# EAGLE schematic uino-1284p (EAGLE 7.7.0)
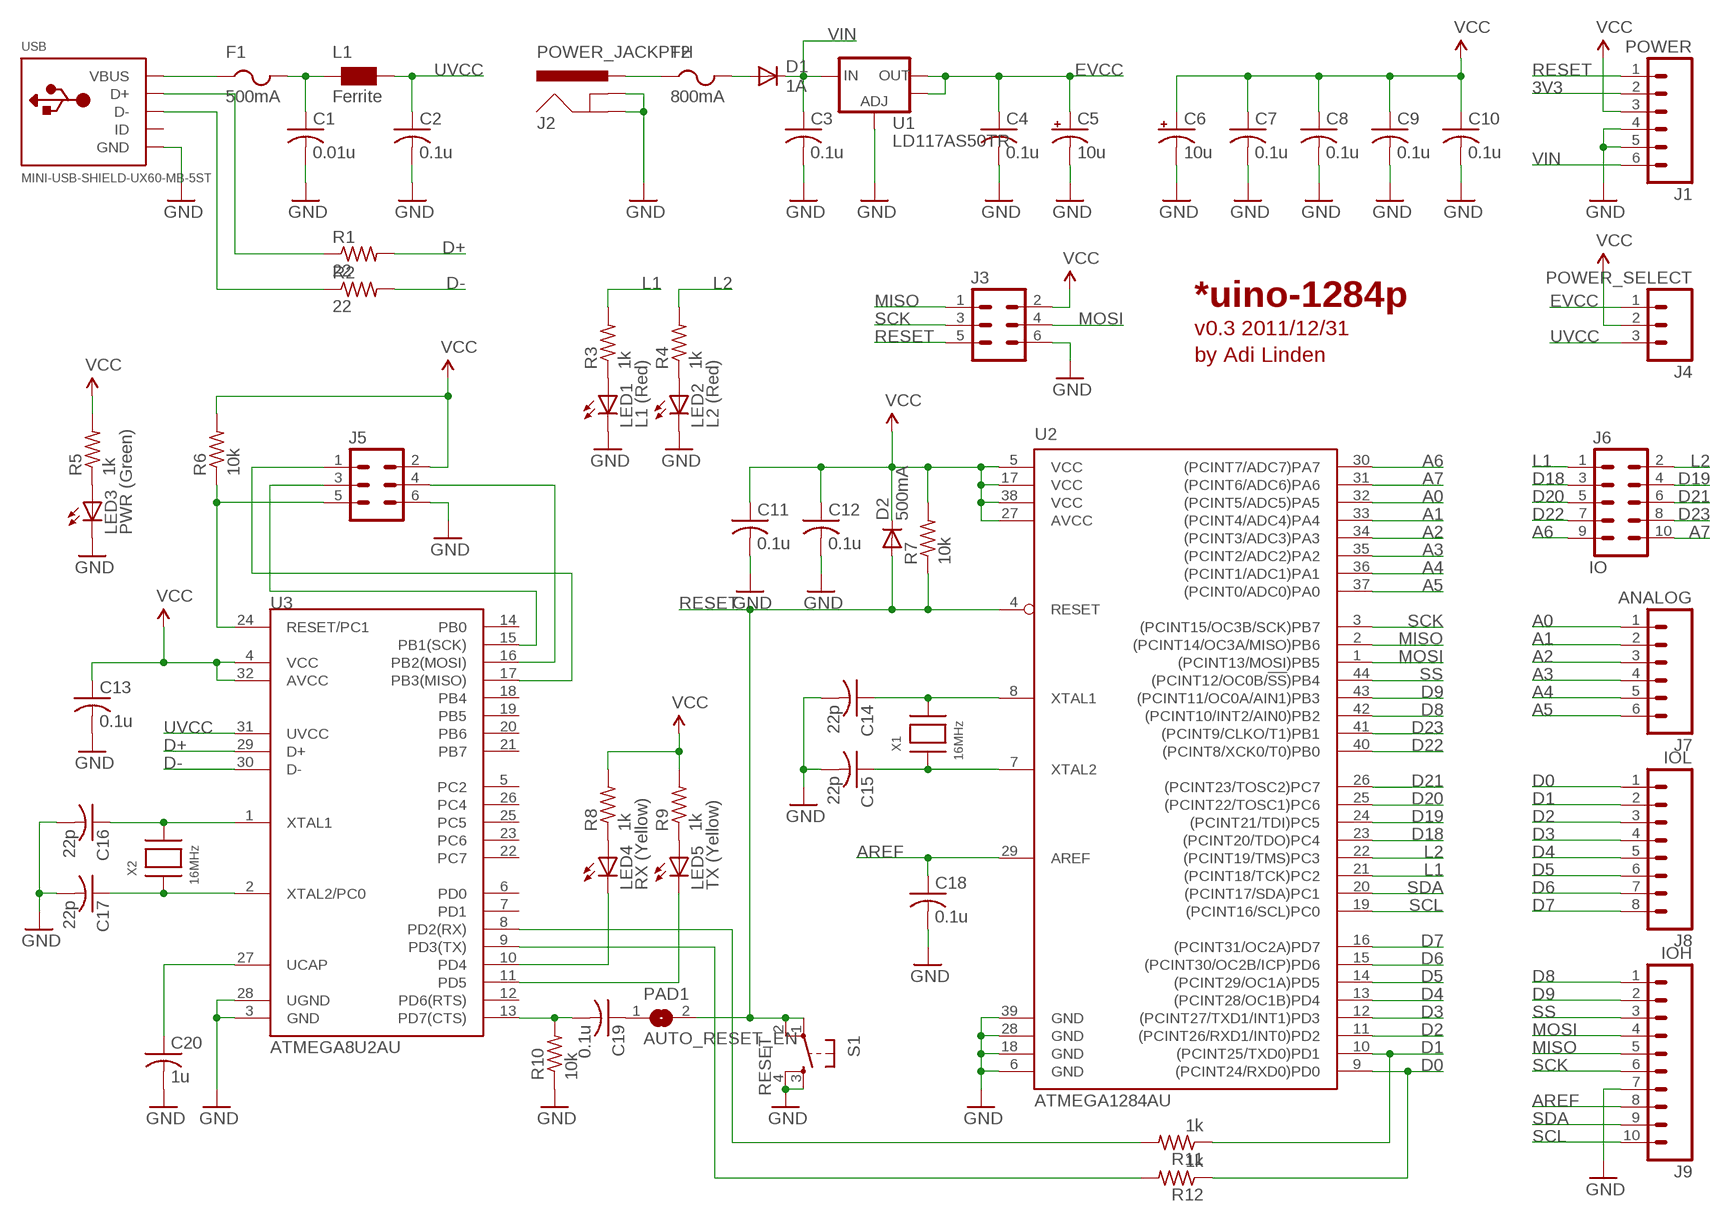
[diagram p0: schematic, sheet 1]

## Parts
C1  0.01u  C-USC0805  [C0805]
C2  0.1u  C-USC0805  [C0805]
C3  0.1u  C-USC0805  [C0805]
C4  0.1u  C-USC0805  [C0805]
C5  10u  CPOL-USCT3216  [CT3216]
C6  10u  CPOL-USCT3216  [CT3216]
C7  0.1u  C-USC0805  [C0805]
C8  0.1u  C-USC0805  [C0805]
C9  0.1u  C-USC0805  [C0805]
C10  0.1u  C-USC0805  [C0805]
C11  0.1u  C-USC0805  [C0805]
C12  0.1u  C-USC0805  [C0805]
C13  0.1u  C-USC0805  [C0805]
C14  22p  C-USC0805  [C0805]
C15  22p  C-USC0805  [C0805]
C16  22p  C-USC0805  [C0805]
C17  22p  C-USC0805  [C0805]
C18  0.1u  C-USC0805  [C0805]
C19  0.1u  C-USC0805  [C0805]
C20  1u  C-USC0805  [C0805]
D1  1A  MBR0520LT  [SOD123]
D2  500mA  MBR0520LT  [SOD123]
F1  500mA  PTCFUSE-0805  [R0805]
F2  800mA  PTCFUSE-0805  [R0805]
J1  POWER  M06SIP  [1X06]
J2  POWER_JACKPTH  [POWER_JACK_PTH]
J3  M03X2  [2X03]
J4  POWER_SELECT  M03PTH  [1X03]
J5  M03X2  [2X03]
J6  IO  M05X2  [2X05]
J7  ANALOG  M06SIP  [1X06]
J8  IOL  M081X08  [1X08]
J9  IOH  M101X10  [1X10]
L1  Ferrite  WE-CBF_0805  [0805]
LED1  L1 (Red)  LEDCHIP-LED0805  [CHIP-LED0805]
LED2  L2 (Red)  LEDCHIP-LED0805  [CHIP-LED0805]
LED3  PWR (Green)  LEDCHIP-LED0805  [CHIP-LED0805]
LED4  RX (Yellow)  LEDCHIP-LED0805  [CHIP-LED0805]
LED5  TX (Yellow)  LEDCHIP-LED0805  [CHIP-LED0805]
PAD1  AUTO_RESET_EN  SJ  [SJ]
R1  22  R-US_R0805  [R0805]
R2  22  R-US_R0805  [R0805]
R3  1k  R-US_R0805  [R0805]
R4  1k  R-US_R0805  [R0805]
R5  1k  R-US_R0805  [R0805]
R6  10k  R-US_R0805  [R0805]
R7  10k  R-US_R0805  [R0805]
R8  1k  R-US_R0805  [R0805]
R9  1k  R-US_R0805  [R0805]
R10  10k  R-US_R0805  [R0805]
R11  1k  R-US_R0805  [R0805]
R12  1k  R-US_R0805  [R0805]
S1  RESET  TAC_SWITCHSMD  [TACTILE_SWITCH_SMD]
U1  LD117AS50TR  V_REG_LM1117SOT223  [SOT223]
U2  ATMEGA1284AU  ATMEGA1284P-AU  [TQFP44]
U3  ATMEGA8U2AU  [TQFP32-08]
USB  MINI-USB-SHIELD-UX60-MB-5ST  USBMINIB  [USB-MINIB]
X1  16MHz  XTALNX5032  [NX5032]
X2  16MHz  XTALNX5032  [NX5032]

## Nets
3V3: J1.2
A0: J7.1 U2.32((PCINT5/ADC5)PA5)
A1: J7.2 U2.33((PCINT4/ADC4)PA4)
A2: J7.3 U2.34((PCINT3/ADC3)PA3)
A3: J7.4 U2.35((PCINT2/ADC2)PA2)
A4: J7.5 U2.36((PCINT1/ADC1)PA1)
A5: J7.6 U2.37((PCINT0/ADC0)PA0)
A6: J6.9 U2.30((PCINT7/ADC7)PA7)
A7: J6.10 U2.31((PCINT6/ADC6)PA6)
AREF: C18.1 J9.8 U2.29(AREF)
D0: J8.1 R12.1 U2.9((PCINT24/RXD0)PD0)
D1: J8.2 R11.1 U2.10((PCINT25/TXD0)PD1)
D2: J8.3 U2.11((PCINT26/RXD1/INT0)PD2)
D3: J8.4 U2.12((PCINT27/TXD1/INT1)PD3)
D4: J8.5 U2.13((PCINT28/OC1B)PD4)
D5: J8.6 U2.14((PCINT29/OC1A)PD5)
D6: J8.7 U2.15((PCINT30/OC2B/ICP)PD6)
D7: J8.8 U2.16((PCINT31/OC2A)PD7)
D8: J9.1 U2.42((PCINT10/INT2/AIN0)PB2)
D9: J9.2 U2.43((PCINT11/OC0A/AIN1)PB3)
D18: J6.3 U2.23((PCINT20/TDO)PC4)
D19: J6.4 U2.24((PCINT21/TDI)PC5)
D20: J6.5 U2.25((PCINT22/TOSC1)PC6)
D21: J6.6 U2.26((PCINT23/TOSC2)PC7)
D22: J6.7 U2.40((PCINT8/XCK0/T0)PB0)
D23: J6.8 U2.41((PCINT9/CLKO/T1)PB1)
D+: R1.2 U3.29(D+)
D-: R2.2 U3.30(D-)
EVCC: C4.1 C5.+ J4.1 U1.2(OUT) U1.4(OUT)
GND: C1.2 C2.2 C3.2 C4.2 C5.- C6.- C7.2 C8.2 C9.2 C10.2 C11.2 C12.2 C13.2 C14.2 C15.2 C16.2 C17.2 C18.2 C20.2 J1.4 J1.5 J2.GND J2.GNDBREAK J3.6 J5.6 J9.7 LED1.C LED2.C LED3.C R10.1 S1.3 S1.4 U1.1(ADJ) U2.6(GND) U2.18(GND) U2.28(GND) U2.39(GND) U3.3(GND) U3.28(UGND) USB.GND
L1: J6.1 R3.2 U2.21((PCINT18/TCK)PC2)
L2: J6.2 R4.2 U2.22((PCINT19/TMS)PC3)
MISO: J3.1 J9.5 U2.2((PCINT14/OC3A/MISO)PB6)
MOSI: J3.4 J9.4 U2.1((PCINT13/MOSI)PB5)
N$1: D1.A F2.2
N$2: C1.1 F1.2 L1.1
N$3: C19.1 PAD1.1
N$4: R2.1 USB.D-
N$5: R1.1 USB.D+
N$6: R12.2 U3.9(PD3(TX))
N$7: R11.2 U3.8(PD2(RX))
N$8: C16.1 U3.1(XTAL1) X2.P$2
N$9: C17.1 U3.2(XTAL2/PC0) X2.P$1
N$10: C20.1 U3.27(UCAP)
N$11: LED1.A R3.1
N$12: LED2.A R4.1
N$13: J5.1 U3.17(PB3(MISO))
N$14: J5.3 U3.15(PB1(SCK))
N$15: J5.5 R6.1 U3.24(RESET/PC1)
N$16: J5.4 U3.16(PB2(MOSI))
N$23: C14.1 U2.8(XTAL1) X1.P$2
N$24: C15.1 U2.7(XTAL2) X1.P$1
N$25: F2.1 J2.PWR
N$26: LED4.A R8.1
N$27: LED5.A R9.1
N$29: LED4.C U3.10(PD4)
N$30: LED5.C U3.11(PD5)
N$31: C19.2 R10.2 U3.13(PD7(CTS))
N$34: LED3.A R5.1
RESET: D2.A J1.1 J3.5 PAD1.2 R7.1 S1.1 S1.2 U2.4(RESET)
SCK: J3.3 J9.6 U2.3((PCINT15/OC3B/SCK)PB7)
SCL: J9.10 U2.19((PCINT16/SCL)PC0)
SDA: J9.9 U2.20((PCINT17/SDA)PC1)
SS: J9.3 U2.44((PCINT12/OC0B/!SS!)PB4)
UVCC: C2.1 J4.3 L1.2 U3.31(UVCC)
VBUS: F1.1 USB.VBUS
VCC: C6.+ C7.1 C8.1 C9.1 C10.1 C11.1 C12.1 C13.1 D2.C J1.3 J3.2 J4.2 J5.2 R5.2 R6.2 R7.2 R8.2 R9.2 U2.5(VCC) U2.17(VCC) U2.27(AVCC) U2.38(VCC) U3.4(VCC) U3.32(AVCC)
VIN: C3.1 D1.C J1.6 U1.3(IN)
Unconnected: U3.5(PC2) U3.6(PD0) U3.7(PD1) U3.12(PD6(RTS)) U3.14(PB0) U3.18(PB4) U3.19(PB5) U3.20(PB6) U3.21(PB7) U3.22(PC7) U3.23(PC6) U3.25(PC5) U3.26(PC4) USB.ID

## Notes on the sheet
- *uino-1284p
- v0.3 2011/12/31
- by Adi Linden

## Library data of the parts
C1-C4 C7-C20 = rcl:C-US: CAPACITOR, American symbol
C5 C6 = rcl:CPOL-US: POLARIZED CAPACITOR, American symbol
D1 D2 = diode:MBR0520LT: SCHOTTKY BARRIER RECTIFIER Source: http://onsemi.com .. MBR0520LT1-D.pdf
F1 F2 = adilinden:PTCFUSE: PTC fuses, resettable thermistors
J1 J7 = SparkFun:M06: Header 6 Standard 6-pin 0.1" header. Use with straight break away headers (SKU : PRT-00116), right angle break away headers (PRT-00553), swiss pins (PRT-00743), machine pins (PRT-00117), and female headers (PRT-00115). Molex polarized connector foot print use with SKU : PRT-08094 with associated crimp pins and housings. NOTES ON THE VARIANTS LOCK and LOCK_LONGPADS... This footprint was designed to help hold the alignment of a through-hole component (i.e. 6-pin header) while soldering it into place. You may notice that each hole has been shifted either up or down by 0.005 of an inch from it's more standard position (which is a perfectly straight line). This slight alteration caused the pins (the squares in the middle) to touch the edges of the holes. Because they are alternating, it causes a "brace" to hold the component in place. 0.005 has proven to be the perfect amount of "off-center" position when using our standard breakaway headers. Although looks a little odd when you look at the bare footprint, once you have a header in there, the alteration is very hard to notice. Also, if you push a header all the way into place, it is covered up entirely on the bottom side. This idea of altering the position of holes to aid alignment will be further integrated into the Sparkfun Library for other footprints. It can help hold any component with 3 or more connection pins.
J2 = SparkFun:POWER_JACK: Power Jack This is the standard 5.5mm barrel jack for power. The PTH is the most common, proven, reliable, footprint. All others are experimental. The Slot footprint only works if the mill layer is transmitted to the PCB fab house so be warned. Spark Fun Electronics SKU : PRT-00119. Mating wall wart : TOL-00298 (and others)
J3 J5 = adilinden:M03X2: This is a 3x2 pin header Note: This part is based on the Sparkfun M04X2 header.
J4 = SparkFun:M03: Header 3 Standard 3-pin 0.1" header. Use with straight break away headers (SKU : PRT-00116), right angle break away headers (PRT-00553), swiss pins (PRT-00743), machine pins (PRT-00117), and female headers (PRT-00115). Molex polarized connector foot print use with SKU : PRT-08232 with associated crimp pins and housings.
J6 = adilinden:M05X2
J8 = SparkFun:M08: Header 8 Standard 8-pin 0.1" header. Use with straight break away headers (SKU : PRT-00116), right angle break away headers (PRT-00553), swiss pins (PRT-00743), machine pins (PRT-00117), and female headers (PRT-00115).
J9 = adilinden:M10: Header 10 Standard 10-pin 0.1" header. Use with straight break away headers (SKU : PRT-00116), right angle break away headers (PRT-00553), swiss pins (PRT-00743), machine pins (PRT-00117), and female headers (PRT-00115). Note: This part is based on the Sparkfun M08 library part.
L1 = wuerth-elektronik:WE-CBF: SMD EMI Suppression Ferrite Beads - excellent anti-EMI properties - low DCR - impedances till 3000 ohms - rated current up to 6 A
LED1-LED5 = adafruit:LED: LED OSRAM: - CHIPLED LG R971, LG N971, LY N971, LG Q971, LY Q971, LO R971, LY R971 LH N974, LH R974 LS Q976, LO Q976, LY Q976 LO Q996 - Hyper CHIPLED LW Q18S LB Q993, LB Q99A, LB R99A - SideLED LS A670, LO A670, LY A670, LG A670, LP A670 LB A673, LV A673, LT A673, LW A673 LH A674 LY A675 LS A676, LA A676, LO A676, LY A676, LW A676 LS A679, LY A679, LG A679 - Hyper Micro SIDELED® LS Y876, LA Y876, LO Y876, LY Y876 LT Y87S - SmartLED LW L88C, LW L88S LB L89C, LB L89S, LG L890 LS L89K, LO L89K, LY L89K LS L896, LA L896, LO L896, LY L896 - TOPLED LS T670, LO T670, LY T670, LG T670, LP T670 LSG T670, LSP T670, LSY T670, LOP T670, LYG T670 LG T671, LOG T671, LSG T671 LB T673, LV T673, LT T673, LW T673 LH T674 LS T676, LA T676, LO T676, LY T676, LB T676, LH T676, LSB T676, LW T676 LB T67C, LV T67C, LT T67C, LS T67K, LO T67K, LY T67K, LW E67C LS E67B, LA E67B, LO E67B, LY E67B, LB E67C, LV E67C, LT E67C LW T67C LS T679, LY T679, LG T679 LS T770, LO T770, LY T770, LG T770, LP T770 LB T773, LV T773, LT T773, LW T773 LH T774 LS E675, LA E675, LY E675, LS T675 LS T776, LA T776, LO T776, LY T776, LB T776 LHGB T686 LT T68C, LB T68C - Hyper Mini TOPLED® LB M676 - Mini TOPLED Santana® LG M470 LS M47K, LO M47K, LY M47K Source: http://www.osram.convergy.de/
PAD1 = jumper:SJ: SMD solder JUMPER
R1-R12 = rcl:R-US_: RESISTOR, American symbol
S1 = SparkFun:TAC_SWITCH: Momentary Switch Button commonly used for reset or general input. Spark Fun Electronics SKU : COM-00097
U1 = adilinden:V_REG_LM1117: Voltage Regulator LM1117 Standard adjustable voltage regulator but in SMD form. Spark Fun Electronics SKU : COM-00595
U2 = adilinden:ATMEGA1284P: 8-bit Microcontroller with 64K Bytes In-System Programmable Flash Source: http://www.atmel.com/dyn/resources/prod_documents/doc2593.pdf; MPN: ATMEGA644PV-10AU; OC_FARNELL: 1455123; OC_NEWARK: 58M3748
U3 = SparkFun:ATMEGA8U2: Atmel 8-bit Microcontroller with 8/16/32K Bystes of ISP Flash and USB Controller. ATmega8U2, ATmega16U2, and ATmega32U2
USB = adafruit:USB: USB Connectors USBMINIB - Surface Mount Female Mini-B USB Connector 4UConnector: 06564 By microbuilder.eu Thru-hole RA Female Mini-B USB Connector 4UConnector: 18732 By ladyada.net
X1 X2 = adafruit:XTAL: Low cost SMT crystals, no capacitors included http://www.ladyada.net/library/eagle